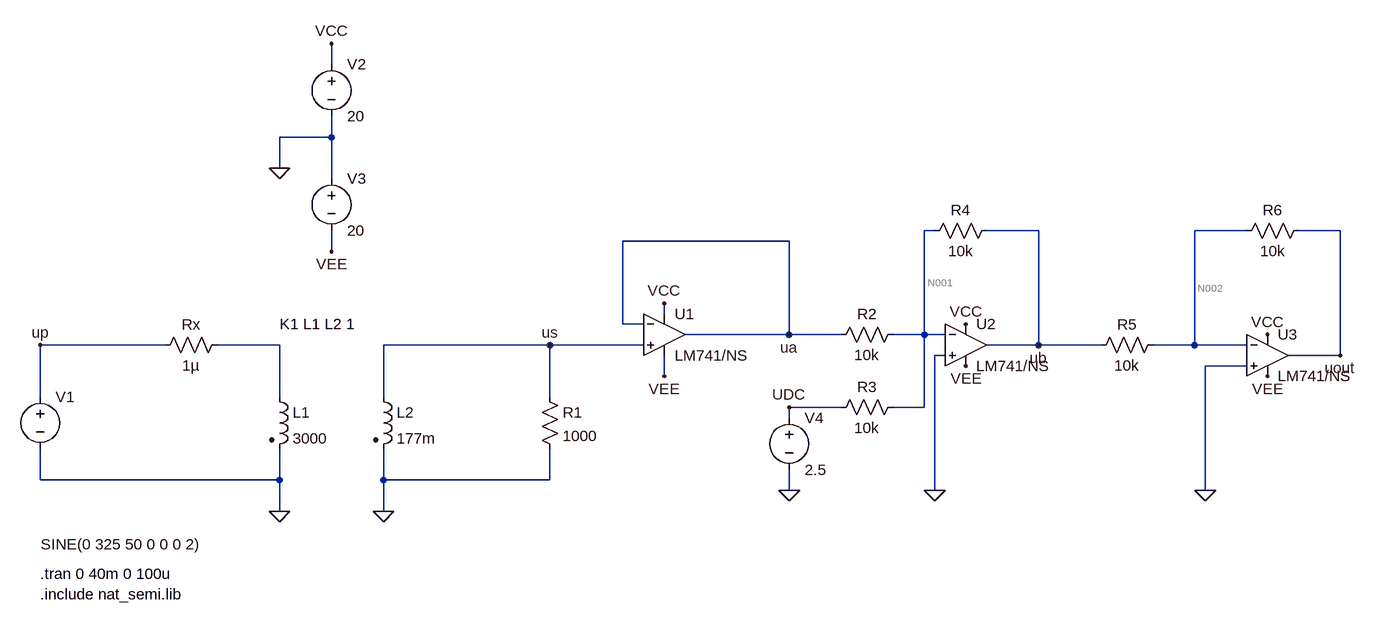
[diagram p0: schematic analog3.asc]
analog3.asc, the LTspice schematic file:
Version 4
SHEET 1 1868 680
WIRE 272 -192 272 -224
WIRE 272 -80 272 -112
WIRE 272 -80 192 -80
WIRE 192 -32 192 -80
WIRE 272 -16 272 -80
WIRE 1200 64 1184 64
WIRE 1360 64 1280 64
WIRE 1680 64 1600 64
WIRE 1824 64 1760 64
WIRE 976 80 720 80
WIRE 272 96 272 64
WIRE 784 192 784 176
WIRE 720 208 720 80
WIRE 752 208 720 208
WIRE 976 224 976 80
WIRE 976 224 816 224
WIRE 1056 224 976 224
WIRE 1184 224 1184 64
WIRE 1184 224 1136 224
WIRE 1216 224 1184 224
WIRE 16 240 -176 240
WIRE 192 240 96 240
WIRE 608 240 352 240
WIRE 752 240 608 240
WIRE 1360 240 1360 64
WIRE 1360 240 1280 240
WIRE 1456 240 1360 240
WIRE 1600 240 1600 64
WIRE 1600 240 1536 240
WIRE 1680 240 1600 240
WIRE 1216 256 1200 256
WIRE 1824 256 1824 64
WIRE 1824 256 1744 256
WIRE 1680 272 1616 272
WIRE 784 288 784 256
WIRE -176 320 -176 240
WIRE 192 320 192 240
WIRE 352 320 352 240
WIRE 608 320 608 240
WIRE 1056 336 976 336
WIRE 1184 336 1184 224
WIRE 1184 336 1136 336
WIRE 976 352 976 336
WIRE -176 448 -176 400
WIRE 192 448 192 400
WIRE 192 448 -176 448
WIRE 352 448 352 400
WIRE 608 448 608 400
WIRE 608 448 352 448
WIRE 976 464 976 432
WIRE 1200 464 1200 256
WIRE 1616 464 1616 272
WIRE 192 496 192 448
WIRE 352 496 352 448
FLAG 192 -32 0
FLAG 272 96 VEE
FLAG 272 -224 VCC
FLAG 192 496 0
FLAG 352 496 0
FLAG 784 288 VEE
FLAG 784 176 VCC
FLAG 976 336 UDC
FLAG 1200 464 0
FLAG 976 464 0
FLAG 976 224 ua
FLAG 1360 240 ub
FLAG 1616 464 0
FLAG 1712 224 VCC
FLAG 1712 288 VEE
FLAG 1824 256 uout
FLAG 1248 208 VCC
FLAG 1248 272 VEE
FLAG -176 240 up
FLAG 608 240 us
SYMBOL voltage -176 304 R0
WINDOW 3 1 243 Left 2
WINDOW 123 0 0 Left 0
WINDOW 39 0 0 Left 0
SYMATTR Value SINE(0 325 50 0 0 0 2)
SYMATTR InstName V1
SYMBOL voltage 272 -208 R0
SYMATTR InstName V2
SYMATTR Value 20
SYMBOL voltage 272 -32 R0
SYMATTR InstName V3
SYMATTR Value 20
SYMBOL res 112 224 R90
WINDOW 0 0 56 VBottom 2
WINDOW 3 32 56 VTop 2
SYMATTR InstName Rx
SYMATTR Value 1µ
SYMBOL ind2 176 304 R0
SYMATTR InstName L1
SYMATTR Value 3000
SYMATTR Type ind
SYMBOL ind2 336 304 R0
SYMATTR InstName L2
SYMATTR Value 177m
SYMATTR Type ind
SYMBOL res 592 304 R0
SYMATTR InstName R1
SYMATTR Value 1000
SYMBOL Opamps\\opamp2 784 160 R0
SYMATTR InstName U1
SYMATTR Value LM741/NS
SYMBOL res 1152 208 R90
WINDOW 0 0 56 VBottom 2
WINDOW 3 32 56 VTop 2
SYMATTR InstName R2
SYMATTR Value 10k
SYMBOL Opamps\\opamp2 1248 176 R0
SYMATTR InstName U2
SYMATTR Value LM741/NS
SYMBOL res 1152 320 R90
WINDOW 0 0 56 VBottom 2
WINDOW 3 32 56 VTop 2
SYMATTR InstName R3
SYMATTR Value 10k
SYMBOL voltage 976 336 R0
SYMATTR InstName V4
SYMATTR Value 2.5
SYMBOL res 1296 48 R90
WINDOW 0 0 56 VBottom 2
WINDOW 3 32 56 VTop 2
SYMATTR InstName R4
SYMATTR Value 10k
SYMBOL res 1552 224 R90
WINDOW 0 0 56 VBottom 2
WINDOW 3 32 56 VTop 2
SYMATTR InstName R5
SYMATTR Value 10k
SYMBOL Opamps\\opamp2 1712 192 R0
SYMATTR InstName U3
SYMATTR Value LM741/NS
SYMBOL res 1776 48 R90
WINDOW 0 0 56 VBottom 2
WINDOW 3 32 56 VTop 2
SYMATTR InstName R6
SYMATTR Value 10k
TEXT -176 592 Left 2 !.tran 0 40m 0 100u
TEXT -176 624 Left 2 !.include nat_semi.lib
TEXT 192 208 Left 2 !K1 L1 L2 1

The netlist it stands for:
* analog3.asc
V1 up 0 SINE(0 325 50 0 0 0 2)
V2 VCC 0 20
V3 0 VEE 20
Rx N003 up 1µ
L1 N003 0 3000
L2 us 0 177m
R1 us 0 1000
XU1 us ua VCC VEE ua LM741/NS  ; pins In+ In- V+ V- OUT
R2 N001 ua 10k
XU2 0 N001 VCC VEE ub LM741/NS  ; pins In+ In- V+ V- OUT
R3 N001 UDC 10k
V4 UDC 0 2.5
R4 ub N001 10k
R5 N002 ub 10k
XU3 0 N002 VCC VEE uout LM741/NS  ; pins In+ In- V+ V- OUT
R6 uout N002 10k
.tran 0 40m 0 100u
.include nat_semi.lib
K1 L1 L2 1
.backanno
.end

* Results of the author's LTspice run, read from the files saved beside the schematic
* Operating Point, zero values left out:
*   V(vcc) = 20 V
*   V(vee) = -20 V
*   V(ua) = 1 mV
*   V(n001) = 1.013 mV
*   V(ub) = -2.497 V
*   V(udc) = 2.5 V
*   V(n002) = 987.3 µV
*   V(uout) = 2.5 V
*   I(L2) = -57.85 nA
*   I(R6) = 249.9 µA
*   I(R5) = 249.8 µA
*   I(R4) = -249.8 µA
*   I(R3) = -249.9 µA
*   I(R2) = 1.279 nA
*   I(V4) = -249.9 µA
*   I(V3) = -5.853 mA
*   I(V2) = -5.603 mA
*   Ix(u1:1) = 57.85 nA
*   Ix(u1:2) = 101.9 nA
*   Ix(u1:99) = 1.826 mA
*   Ix(u1:50) = -1.826 mA
*   Ix(u1:28) = -100.6 nA
*   Ix(u2:1) = 57.81 nA
*   Ix(u2:2) = 101.9 nA
*   Ix(u2:99) = 1.758 mA
*   Ix(u2:50) = -2.258 mA
*   Ix(u2:28) = 499.6 µA
*   Ix(u3:1) = 57.9 nA
*   Ix(u3:2) = 101.8 nA
*   Ix(u3:99) = 2.019 mA
*   Ix(u3:50) = -1.769 mA
*   Ix(u3:28) = -249.9 µA
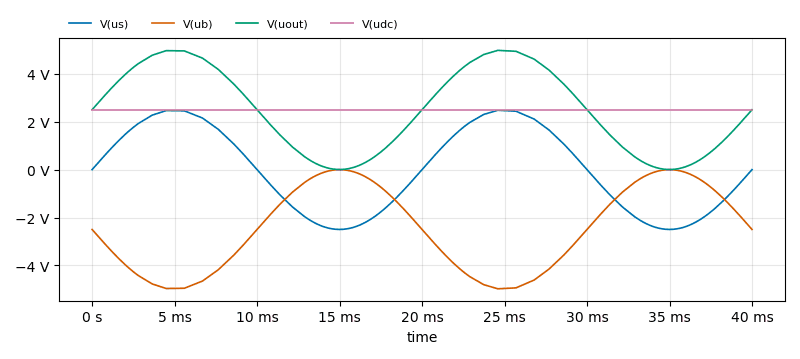
[diagram p1: Transient Analysis of analog3.asc, plotted from the saved traces]
* Transient Analysis, 1 run:
*   V(us): min -2.496 V, max 2.476 V, average -4.303 mV, rms 1.762 V, last 0 V
*   V(ub): min -4.972 V, max -1.164 mV, average -2.493 V, rms 3.052 V, last -2.496 V
*   V(uout): min 4.183 mV, max 4.975 V, average 2.496 V, rms 3.055 V, last 2.499 V
*   V(udc): min 2.5 V, max 2.5 V, average 2.5 V, rms 2.5 V, last 2.5 V